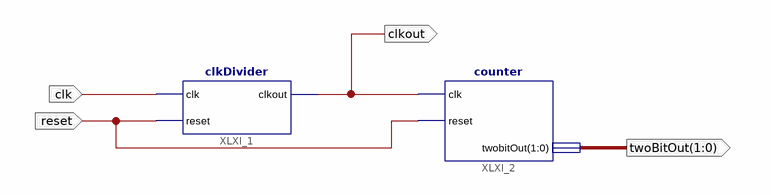
[diagram p0: schematic sheet 1]
// Xilinx ISE schematic top.sch (spartan3e) as structural Verilog: 2 symbols, 4 ports
module top (
  input  reset,
  input  clk,
  output [1:0] twoBitOut,
  output clkout
);

  clkDivider XLXI_1 (.clk(clk), .reset(reset), .clkout(clkout));
  counter XLXI_2 (.clk(clkout), .reset(reset), .twobitOut(twoBitOut));
endmodule
